# Altium schematic sheet Sheet1.SchDoc
size A4
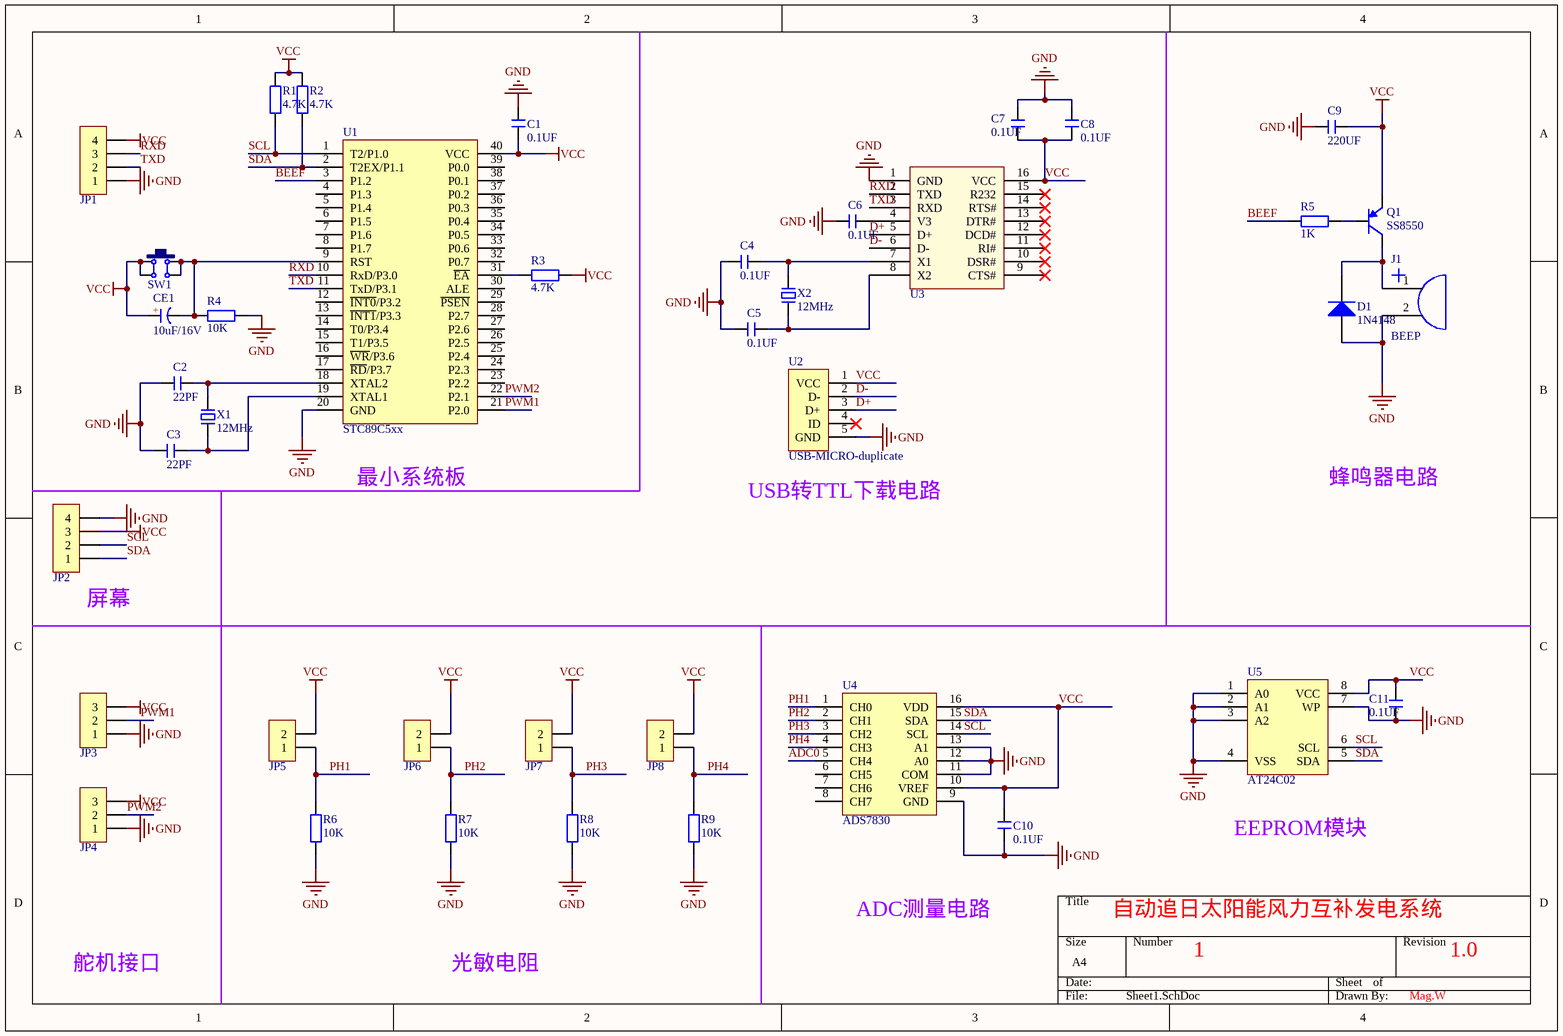
[diagram p0: Sheet1.SchDoc]

## Parts
C1  0.1UF  [C 0805_L]
C2  22PF  [C 0805_L]
C3  22PF  [C 0805_L]
C4  0.1UF  [C 0805_L]
C5  0.1UF  [C 0805_L]
C6  0.1UF  [C 0805_L]
C7  0.1UF  [C 0805_L]
C8  0.1UF  [C 0805_L]
C9  220UF  [C 0805_L]
C10  0.1UF  [C 0805_L]
C11  0.1UF  [C 0805_L]
CE1  10uF/16V  [CAP 1.5*4*8 - BK]
D1  Type: 1N4148  [DIODE-1206]  (hidden comment: Diode)
J1  BEEP  [BUZ-7.5]
JP1  HDR-1X4  [HDR2.0-LI-4P]  (value not drawn)
JP2  HDR-1X4  [HDR2.0-M-LI-4P]  (value not drawn)
JP3  HDR-1X3  [HDR2.0-LI-3P]  (value not drawn)
JP4  HDR-1X3  [HDR2.0-LI-3P]  (value not drawn)
JP5  HDR-1X2  [HDR2.0-LI-2P]  (value not drawn)
JP6  HDR-1X2  [HDR2.0-LI-2P]  (value not drawn)
JP7  HDR-1X2  [HDR2.0-LI-2P]  (value not drawn)
JP8  HDR-1X2  [HDR2.0-LI-2P]  (value not drawn)
Q1  SS8550  [SOT23-3N]
R1  4.7K  [R 0805_L]
R2  4.7K  [R 0805_L]
R3  4.7K  [R 0805_L]
R4  10K  [R 0805_L]
R5  1K  [R 0805_L]
R6  10K  [R 0805_L]
R7  10K  [R 0805_L]
R8  10K  [R 0805_L]
R9  10K  [R 0805_L]
SW1  6x6x5  [TSW DIP-6*6*6]  (value not drawn)
U1  STC89C5xx  [DIP40-600]
U2  USB-MICRO-duplicate  [USB-MICRO - duplicate]
U3  CH340G  [sop16_L]  (value not drawn)
U4  ADS7830  [TSSOP16]
U5  AT24C02  [SOIC8_N]
X1  12MHz  [OSC HC-49S]
X2  12MHz  [OSC HC-49S]

## Nets
GND: C1.2 C2.2 C3.1 C4.2 C5.1 C6.2 C7.2 C8.2 C9.1 C10.2 C11.1 D1.1(A) J1.2 JP1.1 JP2.4 JP3.1 JP4.1 R4.2 R6.1 R7.1 R8.1 R9.1 U1.20(GND) U2.5(GND) U3.1(GND) U4.9(GND) U4.11(COM) U4.12(A0) U4.13(A1) U5.1(A0) U5.2(A1) U5.3(A2) U5.4(VSS) U5.7(WP)
VCC: C1.1 C7.1 C8.1 C9.2 C10.1 C11.2 CE1.1(A) JP1.4 JP2.3 JP3.3 JP4.3 JP5.2 JP6.2 JP7.2 JP8.2 Q1.2(E) R1.2 R2.1 R3.2 SW1.1 SW1.4 U1.40(VCC) U2.1(VCC) U3.16(VCC) U4.10(VREF) U4.16(VDD) U5.8(VCC)
ADC0: U4.5(CH4)
BEEF: R5.2 U1.3(P1.2)
D+: U2.3(D+) U3.5(D+)
D-: U2.2(D-) U3.6(D-)
PH1: JP5.1 R6.2 U4.1(CH0)
PH2: JP6.1 R7.2 U4.2(CH1)
PH3: JP7.1 R8.2 U4.3(CH2)
PH4: JP8.1 R9.2 U4.4(CH3)
PWM1: JP3.2 U1.21(P2.0)
PWM2: JP4.2 U1.22(P2.1)
RXD: JP1.3 U1.10(RxD/P3.0) U3.2(TXD)
SCL: JP2.2 R1.1 U1.1(T2/P1.0) U4.14(SCL) U5.6(SCL)
SDA: JP2.1 R2.2 U1.2(T2EX/P1.1) U4.15(SDA) U5.5(SDA)
TXD: JP1.2 U1.11(TxD/P3.1) U3.3(RXD)
NetC2_1: C2.1 U1.18(XTAL2) X1.2
NetC3_2: C3.2 U1.19(XTAL1) X1.1
NetC4_1: C4.1 U3.7(X1) X2.2
NetC5_2: C5.2 U3.8(X2) X2.1
NetC6_1: C6.1 U3.4(V3)
NetCE1_2: CE1.2(K) R4.1 SW1.2 SW1.3 U1.9(RST)
NetD1_2: D1.2(K) J1.1 Q1.3(C)
NetQ1_1: Q1.1(B) R5.1
NetR3_1: R3.1 U1.31(~{EA})

Not connected (* = marked no-connect by the designer): U1 4(P1.3) 5(P1.4) 6(P1.5) 7(P1.6) 8(P1.7) 12(~{INT0}/P3.2) 13(~{INT1}/P3.3) 14(T0/P3.4) 15(T1/P3.5) 16(~{WR}/P3.6) 17(~{RD}/P3.7) 23(P2.2) 24(P2.3) 25(P2.4) 26(P2.5) 27(P2.6) 28(P2.7) 29(~{PSEN}) 30(ALE) 32(P0.7) 33(P0.6) 34(P0.5) 35(P0.4) 36(P0.3) 37(P0.2) 38(P0.1) 39(P0.0); U2 4(ID)*; U3 9(CTS#)* 10(DSR#)* 11(RI#)* 12(DCD#)* 13(DTR#)* 14(RTS#)* 15(R232)*; U4 6(CH5) 7(CH6) 8(CH7)

## Notes on the sheet
- 最小系统板
- (near U2) USB转TTL下载电路
- 蜂鸣器电路
- (near JP2) 屏幕
- EEPROM模块
- ADC测量电路
- 自动追日太阳能风力互补发电系统
- 舵机接口
- 光敏电阻
- 1
- 1.0
- Mag.W
- (in symbol CE) +

## Library data of the parts
C1-C11 = C: 贴片电容; BOM名称: 无极性贴片电容; 淘宝ID: 封装库来自淘宝 ID：黄晶宝石; 联系售后，技术支持: https://shop463601444.taobao.com; 唯一出售店铺网址: https://shop463601444.taobao.com
CE1 = CE: 直插电解电容; 淘宝ID: 封装库来自淘宝 ID：黄晶宝石; BOM名称: 直插电解电容; 联系售后: https://shop463601444.taobao.com
D1 = Diode: 二极管; Published: 8-Jun-2000; LatestRevisionDate: 17-Jul-2002; LatestRevisionNote: Re-released for DXP Platform.; PackageDocument: Sep-1996; PackageReference: SMC; Publisher: Altium Limited; Code_JEDEC: DO-214-AB
J1 = BEEP: 蜂鸣器
JP1 JP2 = Header 4: 4P接插件; 封装库来自淘宝卖家 ID：黄晶宝石: 其他店铺购入均为盗版，不享受售后技术支持服务，请立即申请退款
JP3 JP4 = Header 3: 3P接插件; 版权归属: 源创客; BOM名称: 3P接插件; 学习资源: www.ooocke.com
JP5-JP8 = Header 2: 2P接插件; 版权归属: 封装库来自淘宝 ID：黄晶宝石; BOM名称: 2P接插件; 技术支持，联系售后: https://shop463601444.taobao.com
Q1 = 8550-SMD: 高频放大-PNP型; 版权归属: 封装库来自淘宝 ID：黄晶宝石; 属性: 40V 1.5A 1W 100MHZ; BOM名称: 高频放大-PNP型; 学习资源: www.ooocke.com
R1-R9 = R: 贴片电阻; 版权归属: 来自淘宝 ID：黄晶宝石; 封装库来自淘宝卖家 ID：黄晶宝石: 其他店铺购入均为盗版，不享受售后技术支持服务，请立即申请退款; BOM名称: 贴片电阻; 联系售后: https://shop463601444.taobao.com
SW1 = TSW DIP-6x6: 直插6x6轻触开关; 版权归属: 封装库来自淘宝 ID：黄晶宝石; BOM名称: 直插6x6轻触开关; 唯一出售店铺网址: https://shop463601444.taobao.com
U1 = STC89C5xx: STC单片机; 版权归属: 封装库来自淘宝 ID：黄晶宝石; BOM名称: STC单片机; 学习资源: https://shop463601444.taobao.com
U3 = CH340G: 技术支持，联系售后: 封装库来自淘宝卖家 ID：黄晶宝石; 唯一出售店铺网址: https://shop463601444.taobao.com
U5 = AT24C02: EEROM存储器
X1 X2 = XTAL-2P: 2脚无源脚晶振; 版权归属: 封装库来自淘宝卖家 ID：黄晶宝石; BOM名称: 2脚无源脚晶振; 学习资源: https://shop463601444.taobao.com